# EasyEDA schematic 1-Schematic_attiny_programmer.json
TITLE: New Schematic; REV: 1.0; Date: 2018-09-01; Sheet: 1/1; Drawn By: spoung123
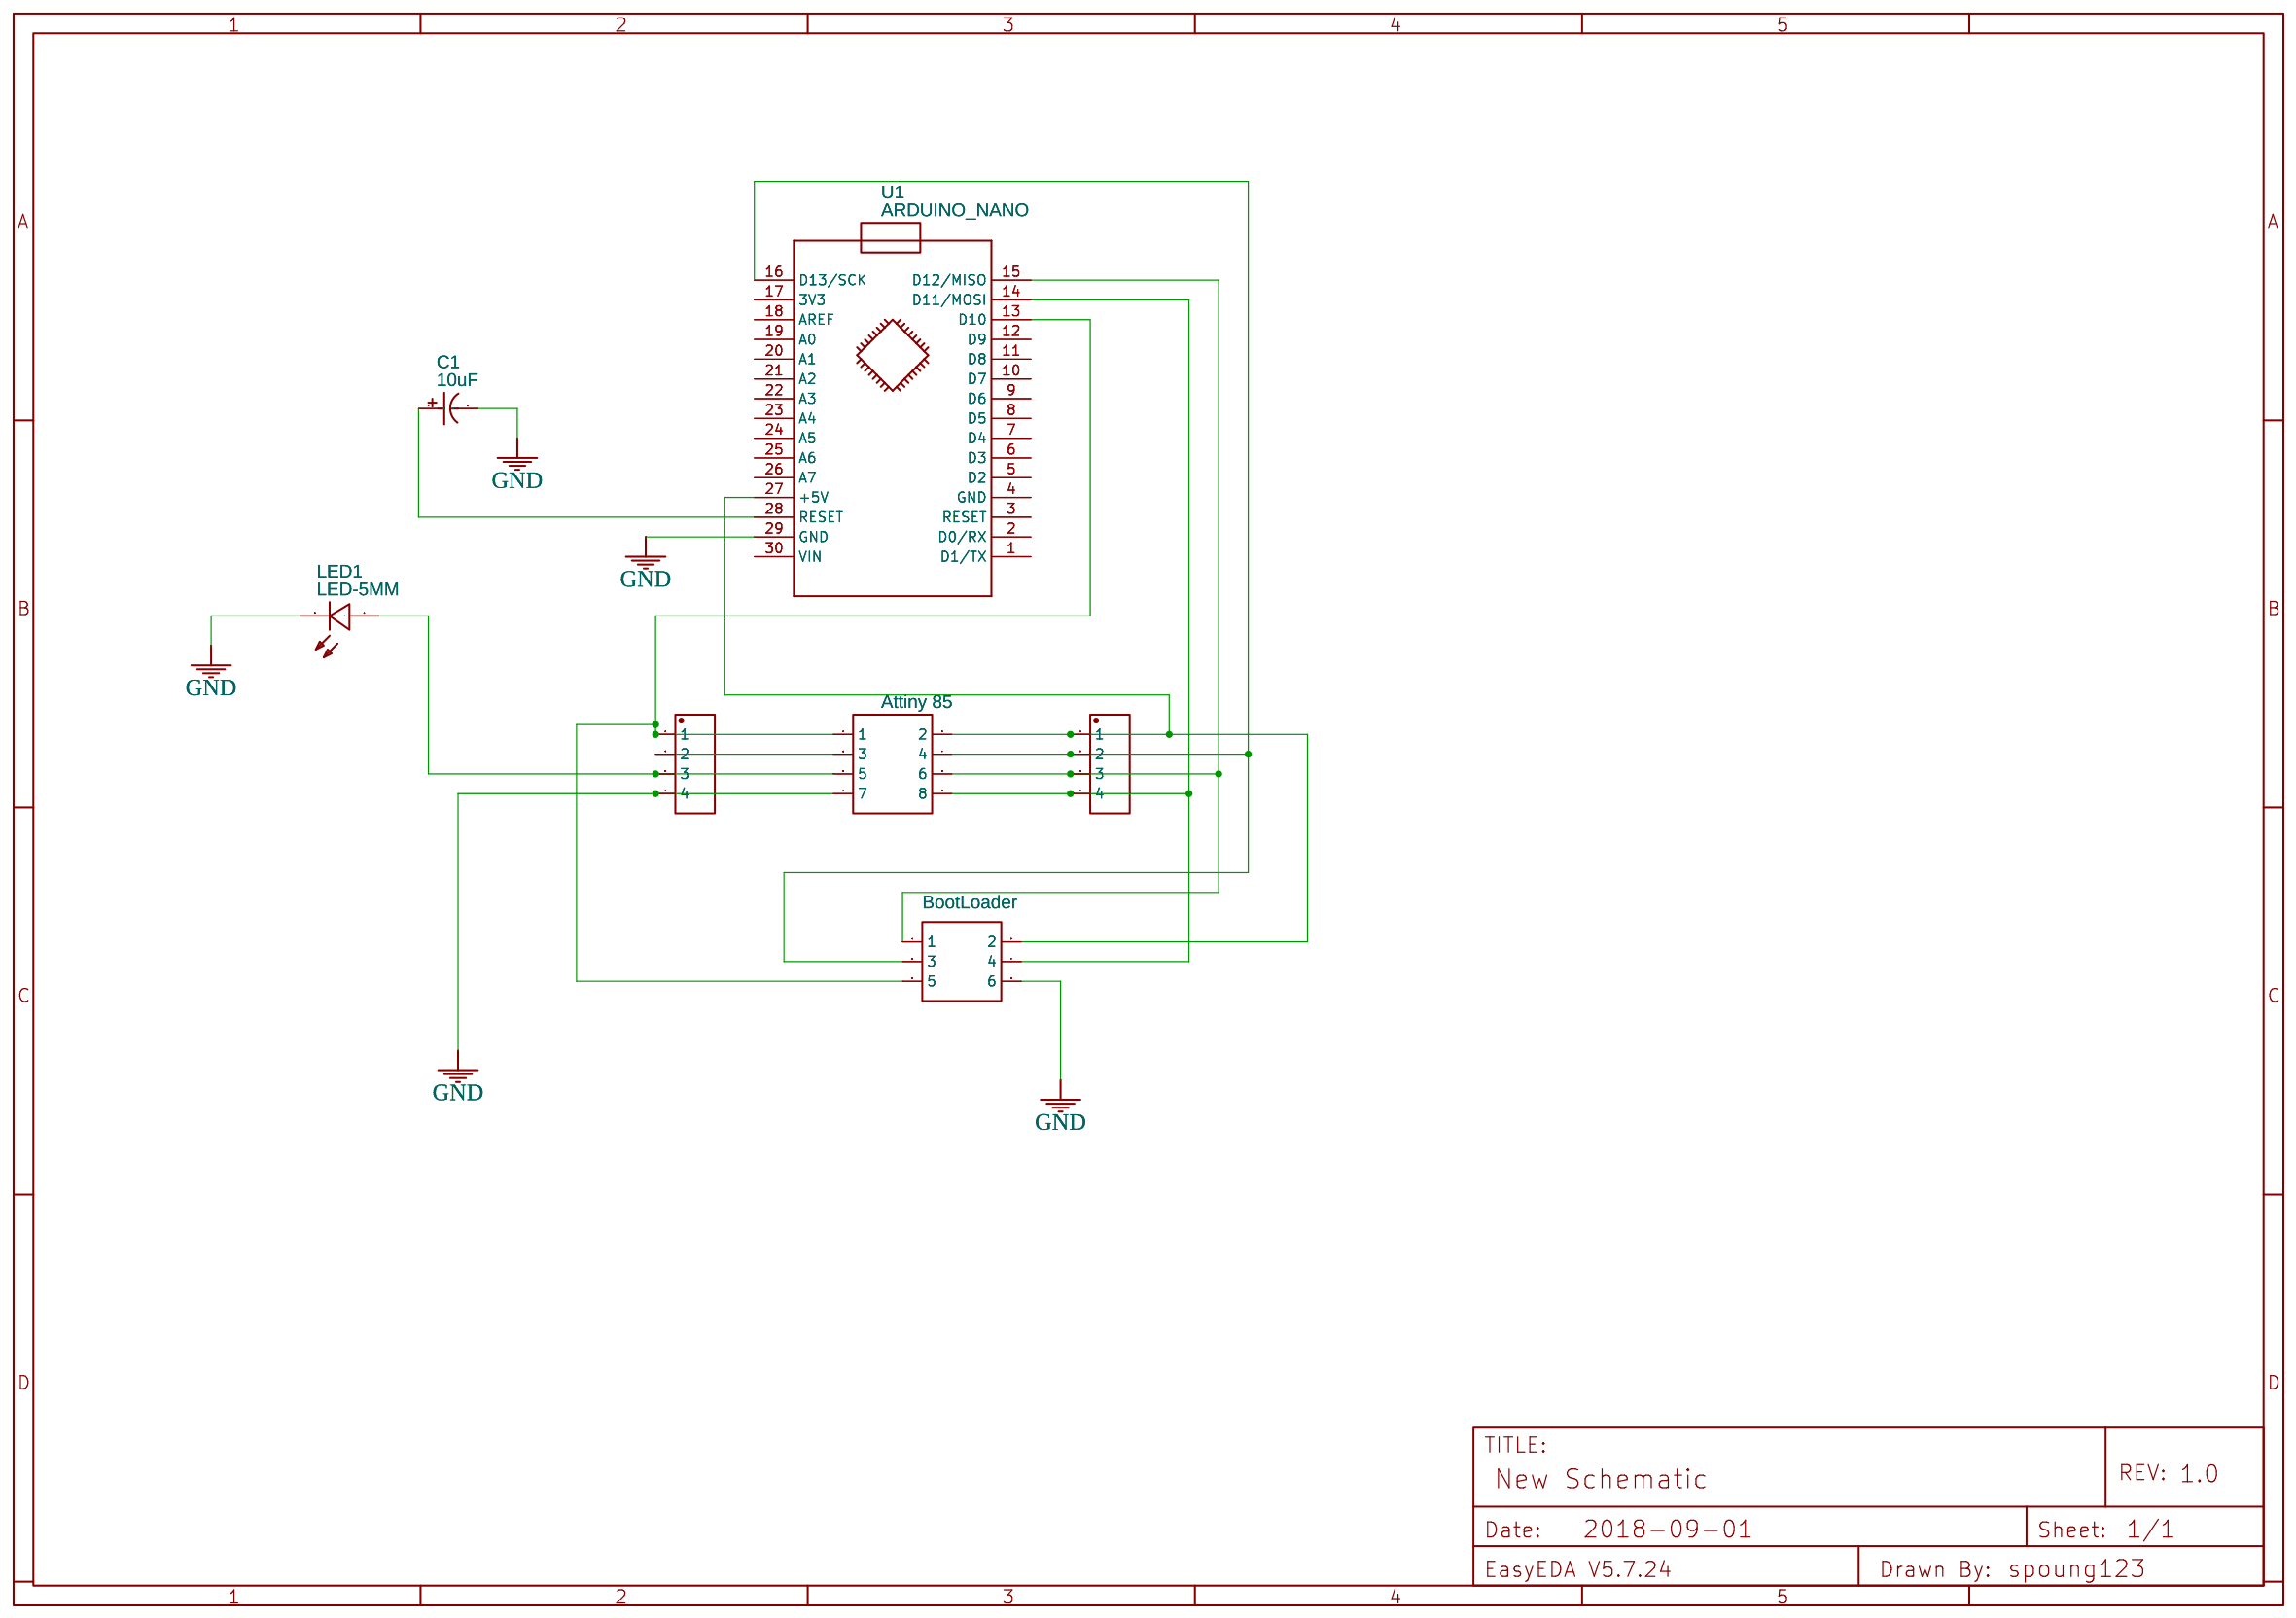
[diagram p0: schematic sheet]

## Parts
C1  10uF  [CAP-D6.3XF2.5]
H1  Attiny 85  [DIP-2X4P-2.54]
H2  Header-Male-2.54_1x4  [DIP-1X4P-2.54MM-M]
H3  Header-Male-2.54_1x4  [DIP-1X4P-2.54MM-M]
LED1  LED-5MM  [LED-5MM/2.54]
P1  BootLoader  [HDR-3X2/2.54]
U1  ARDUINO_NANO  [ARDUINO_NANO]

## Library data of the parts
C1 = 10uf/100V: Supplier: LCSC; Manufacturer: ValuePro; Contributor: LCSC; Supplier Part: C2029
H1 = -: Supplier: LCSC; Manufacturer: Ckmtw; Manufacturer Part: 220S-2*4P H=8.5MM Ytype Gold-plated; Supplier Part: C124422
H2 H3 = -: Supplier: LCSC; Manufacturer: Ckmtw; Manufacturer Part: 210S-1*4P L=11.6MMGold-plated black; Contributor: LCSC; Supplier Part: C124378
LED1 = -: Supplier Part: C52721; Supplier: LCSC; Manufacturer: EVERLIGHT; Manufacturer Part: 5AR2ST10
P1 = -: Supplier: LCSC; Manufacturer: BOOMELE; Manufacturer Part: Header-Male-2.54_2x3; Supplier Part: C65114
U1 = -: sourceId: KGSeAWhDB; Manufacturer Part: ?

## Nets
GND: C1.2 H1.7 H3.4 LED1.2(-) P1.6 U1.29(GND)
H1_3: H1.3 H3.2
LED1_1: H1.5 H3.3 LED1.1(+)
U1_13: H1.1 H3.1 P1.5 U1.13(D10)
U1_14: H1.8 H2.4 P1.4 U1.14(D11/MOSI)
U1_15: H1.6 H2.3 P1.1 U1.15(D12/MISO)
U1_16: H1.4 H2.2 P1.3 U1.16(D13/SCK)
U1_27: H1.2 H2.1 P1.2 U1.27(+5V)
U1_28: C1.1 U1.28(RESET)

Not connected (* = marked no-connect by the designer): U1 1(D1/TX) 2(D0/RX) 3(RESET) 4(GND) 5(D2) 6(D3) 7(D4) 8(D5) 9(D6) 10(D7) 11(D8) 12(D9) 17(3V3) 18(AREF) 19(A0) 20(A1) 21(A2) 22(A3) 23(A4) 24(A5) 25(A6) 26(A7) 30(VIN)
